# EAGLE design W512A (EAGLE 6.6.0)
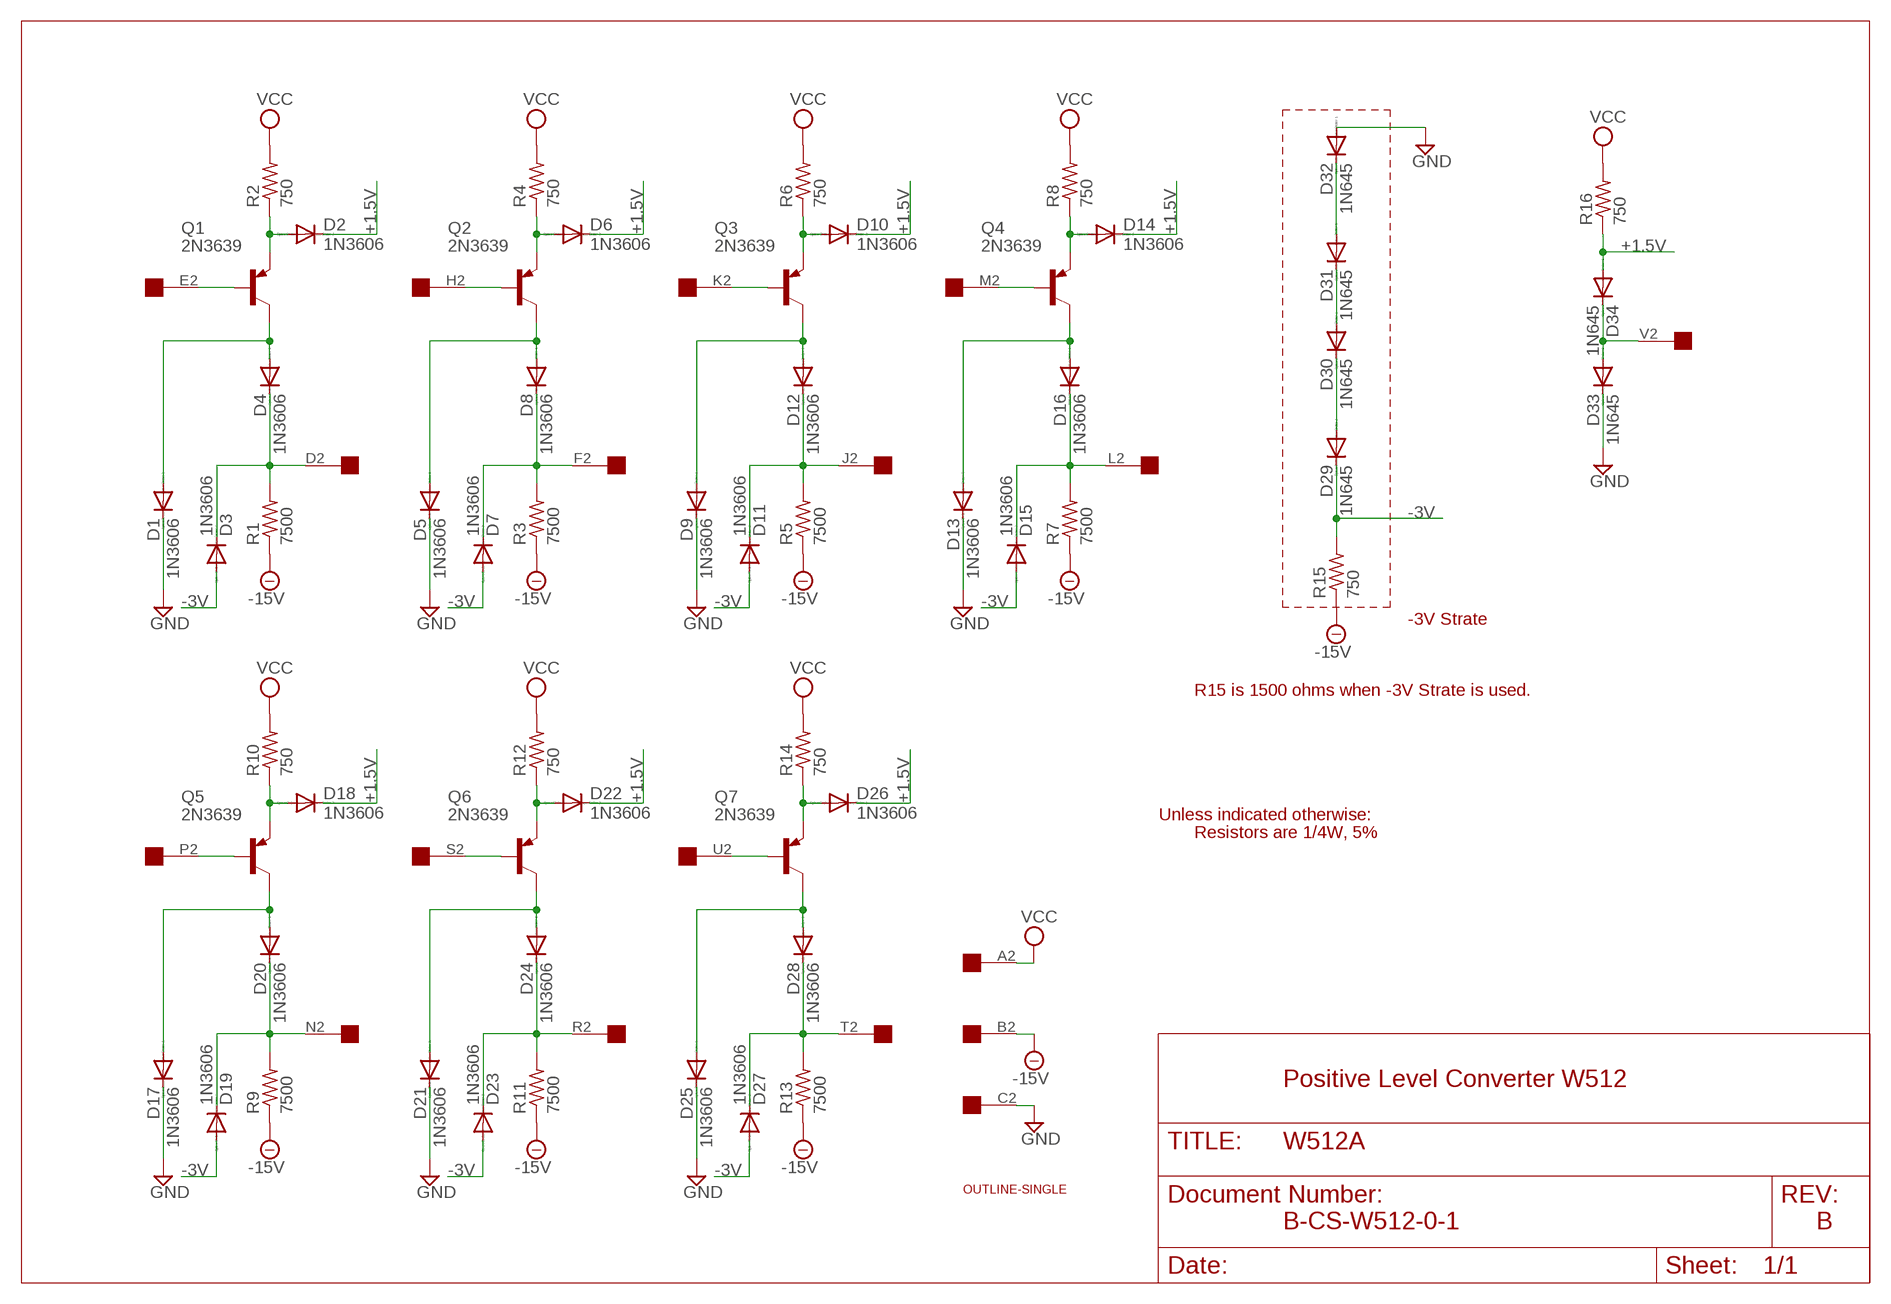
[diagram p0: schematic, sheet 1]

## Parts
D1  1N3606  1N4148DO35-10  [DO35-10]
D2  1N3606  1N4148DO35-10  [DO35-10]
D3  1N3606  1N4148DO35-10  [DO35-10]
D4  1N3606  1N4148DO35-10  [DO35-10]
D5  1N3606  1N4148DO35-10  [DO35-10]
D6  1N3606  1N4148DO35-10  [DO35-10]
D7  1N3606  1N4148DO35-10  [DO35-10]
D8  1N3606  1N4148DO35-10  [DO35-10]
D9  1N3606  1N4148DO35-10  [DO35-10]
D10  1N3606  1N4148DO35-10  [DO35-10]
D11  1N3606  1N4148DO35-10  [DO35-10]
D12  1N3606  1N4148DO35-10  [DO35-10]
D13  1N3606  1N4148DO35-10  [DO35-10]
D14  1N3606  1N4148DO35-10  [DO35-10]
D15  1N3606  1N4148DO35-10  [DO35-10]
D16  1N3606  1N4148DO35-10  [DO35-10]
D17  1N3606  1N4148DO35-10  [DO35-10]
D18  1N3606  1N4148DO35-10  [DO35-10]
D19  1N3606  1N4148DO35-10  [DO35-10]
D20  1N3606  1N4148DO35-10  [DO35-10]
D21  1N3606  1N4148DO35-10  [DO35-10]
D22  1N3606  1N4148DO35-10  [DO35-10]
D23  1N3606  1N4148DO35-10  [DO35-10]
D24  1N3606  1N4148DO35-10  [DO35-10]
D25  1N3606  1N4148DO35-10  [DO35-10]
D26  1N3606  1N4148DO35-10  [DO35-10]
D27  1N3606  1N4148DO35-10  [DO35-10]
D28  1N3606  1N4148DO35-10  [DO35-10]
D29  1N645  1N4148DO35-10  [DO35-10]
D30  1N645  1N4148DO35-10  [DO35-10]
D31  1N645  1N4148DO35-10  [DO35-10]
D32  1N645  1N4148DO35-10  [DO35-10]
D33  1N645  1N4148DO35-10  [DO35-10]
D34  1N645  1N4148DO35-10  [DO35-10]
EDGE  EDGE-1  [EDGE-CON1]
Q1  2N3639  2N2904  [TO39]
Q2  2N3639  2N2904  [TO39]
Q3  2N3639  2N2904  [TO39]
Q4  2N3639  2N2904  [TO39]
Q5  2N3639  2N2904  [TO39]
Q6  2N3639  2N2904  [TO39]
Q7  2N3639  2N2904  [TO39]
R1  7500  R-US_0207/10  [0207/10]
R2  750  R-US_0207/10  [0207/10]
R3  7500  R-US_0207/10  [0207/10]
R4  750  R-US_0207/10  [0207/10]
R5  7500  R-US_0207/10  [0207/10]
R6  750  R-US_0207/10  [0207/10]
R7  7500  R-US_0207/10  [0207/10]
R8  750  R-US_0207/10  [0207/10]
R9  7500  R-US_0207/10  [0207/10]
R10  750  R-US_0207/10  [0207/10]
R11  7500  R-US_0207/10  [0207/10]
R12  750  R-US_0207/10  [0207/10]
R13  7500  R-US_0207/10  [0207/10]
R14  750  R-US_0207/10  [0207/10]
R15  750  R-US_0207/10  [0207/10]
R16  750  R-US_0207/10  [0207/10]
U$1  OUTLINE-SINGLE  [SINGLE]

## Nets
+1.5V: D2.C D6.C D10.C D14.C D18.C D22.C D26.C D34.A R16.1
-3V: D3.A D7.A D11.A D15.A D19.A D23.A D27.A D29.C R15.2
-15V [Supply]: EDGE.B2 R1.1 R3.1 R5.1 R7.1 R9.1 R11.1 R13.1 R15.1
GND [Supply]: D1.C D5.C D9.C D13.C D17.C D21.C D25.C D32.A D33.C EDGE.C2
N$1: D1.A D4.A Q1.3(C)
N$2: D3.C D4.C EDGE.D2 R1.2
N$3: EDGE.H2 Q2.2(B)
N$4: D31.A D32.C
N$5: D30.A D31.C
N$6: D29.A D30.C
N$7: D2.A Q1.1(E) R2.1
N$8: D6.A Q2.1(E) R4.1
N$9: D5.A D8.A Q2.3(C)
N$10: D7.C D8.C EDGE.F2 R3.2
N$11: EDGE.K2 Q3.2(B)
N$12: D10.A Q3.1(E) R6.1
N$13: EDGE.E2 Q1.2(B)
N$14: D9.A D12.A Q3.3(C)
N$15: D11.C D12.C EDGE.J2 R5.2
N$16: EDGE.M2 Q4.2(B)
N$17: D14.A Q4.1(E) R8.1
N$18: D13.A D16.A Q4.3(C)
N$19: D15.C D16.C EDGE.L2 R7.2
N$20: EDGE.P2 Q5.2(B)
N$21: D18.A Q5.1(E) R10.1
N$23: D17.A D20.A Q5.3(C)
N$24: D19.C D20.C EDGE.N2 R9.2
N$25: EDGE.S2 Q6.2(B)
N$26: D22.A Q6.1(E) R12.1
N$27: D21.A D24.A Q6.3(C)
N$28: D23.C D24.C EDGE.R2 R11.2
N$29: EDGE.U2 Q7.2(B)
N$30: D26.A Q7.1(E) R14.1
N$31: D25.A D28.A Q7.3(C)
N$32: D27.C D28.C EDGE.T2 R13.2
N$34: D33.A D34.C EDGE.V2
VCC [Supply]: EDGE.A2 R2.2 R4.2 R6.2 R8.2 R10.2 R12.2 R14.2 R16.2

## Notes on the sheet
- -3V Strate
- R15 is 1500 ohms when -3V Strate is used.
- Unless indicated otherwise:
- Resistors are 1/4W, 5%
- Positive Level Converter W512
- B-CS-W512-0-1 | B

## Library data of the parts
D1-D34 = diode:1N4148: DIODE high speed (Philips)
EDGE = dec-con:EDGE-1: Single-Sided DEC Edge Connector -- (side 2)
Q1-Q7 = transistor-pnp:2N2904*: PNP Transistror
R1-R16 = rcl:R-US_: RESISTOR, American symbol
U$1 = dec-con:OUTLINE-*: Board outlines for DEC boards.

## Net classes
1 Supply: width 0.813 mm

## Board
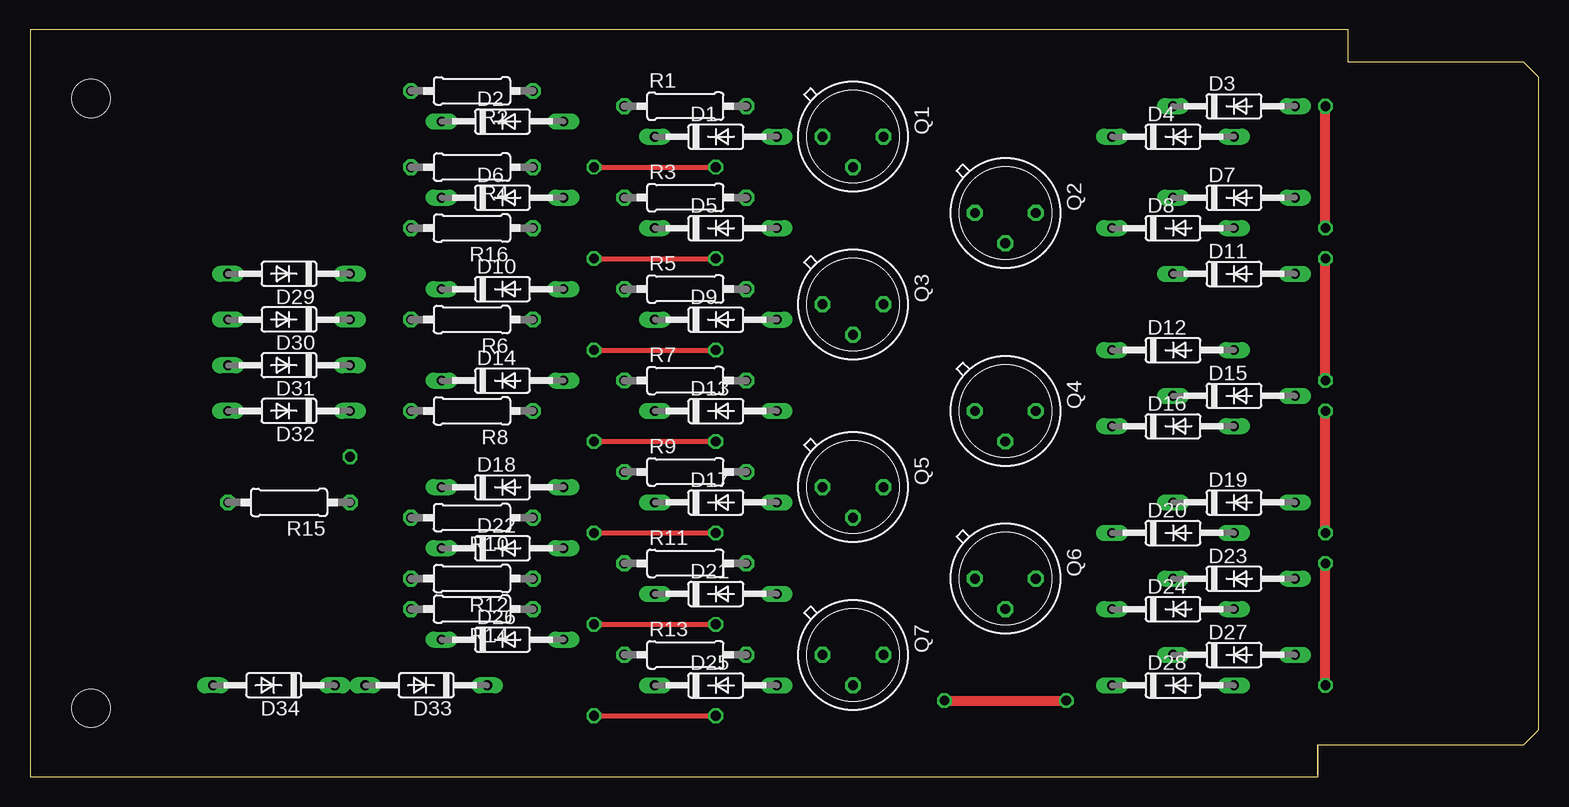
[diagram p1: board, top side]
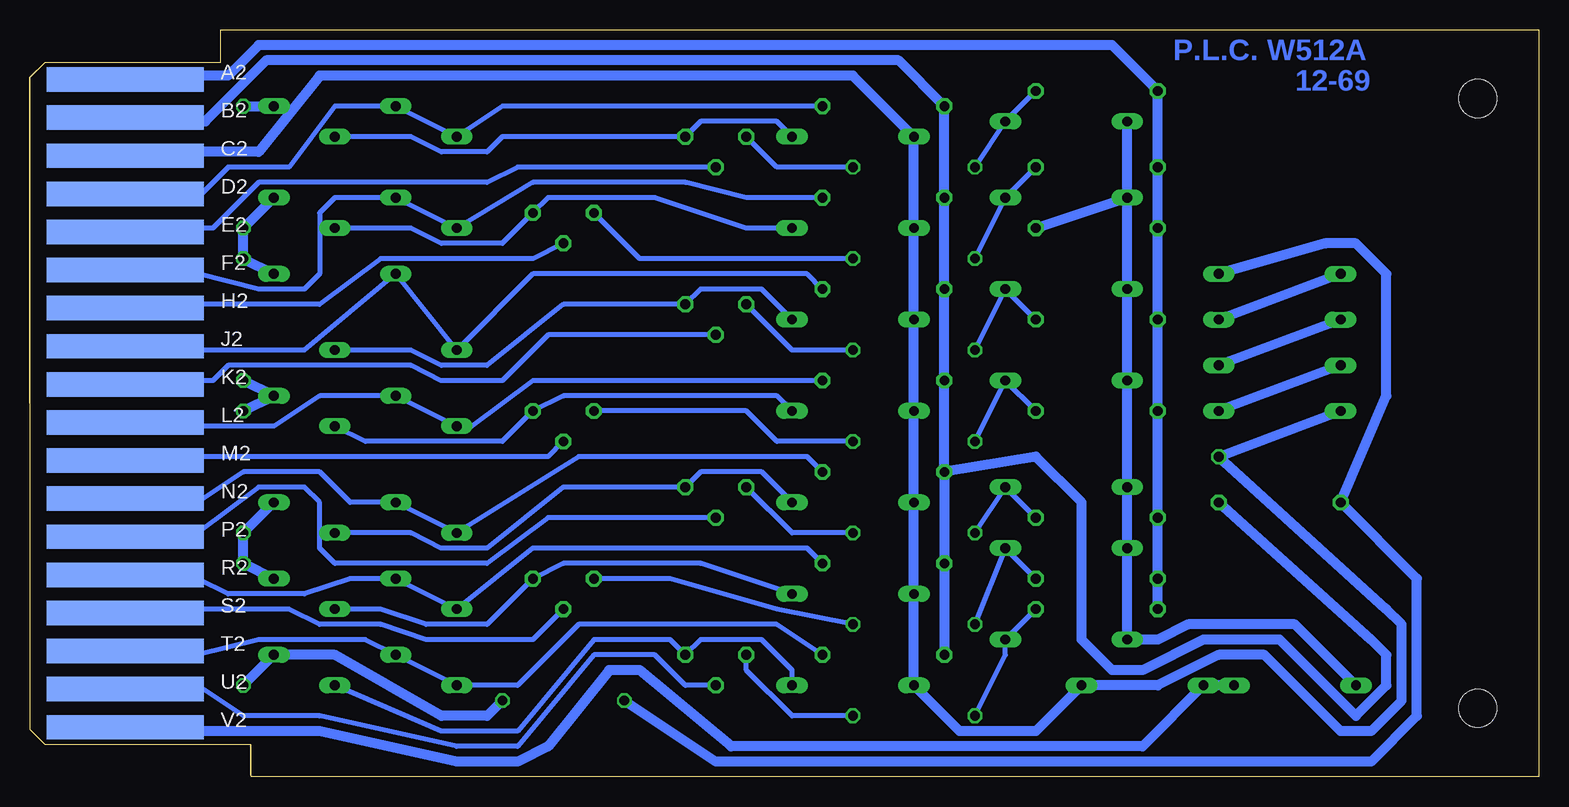
[diagram p2: board, bottom side, seen from below]

Size 125.73 x 62.23 mm. Coordinates in mm from the lower left corner, seen from the top.
Copper layers (1+16): Top 0.035mm / dielectric 1.5mm / Bottom 0.035mm
Design rules "16mils": minimum track width 16mil, minimum drill 32mil, track to track 15mil, track to pad 10mil, pad to pad 10mil, via to via 10mil, smd to smd 10mil, copper to edge 13mil, drill to drill 10mil, minimum pad ring 10mil, minimum via ring 8mil, stop-mask expansion 0mil, vias tented up to drill 0mil, thermal gap 10mil

### Footprints (pad centres in the part's own frame; a part is rotated, then mirrored left to right if it is on the bottom)
DO35-10 = drill 0.813 long: A 5.08,0; C -5.08,0
EDGE-CON1 = smd 13.106 x 2.032 bottom: A2 7.938,4.128; B2 7.938,7.303; C2 7.938,10.477; D2 7.938,13.652; E2 7.938,16.828; F2 7.938,20.003; H2 7.938,23.177; J2 7.938,26.352; K2 7.938,29.527; L2 7.938,32.703; M2 7.938,35.877; N2 7.938,39.053; P2 7.938,42.227; R2 7.938,45.403; S2 7.938,48.578; T2 7.938,51.752; U2 7.938,54.928; V2 7.938,58.102
TO39 = drill 0.813 octagon: 1 0,-2.54; 2 2.54,0; 3 0,2.54
0207/10 = drill 0.813 octagon: 1 -5.08,0; 2 5.08,0
SINGLE = hole 3.175: 120.65,56.515; 120.65,5.715

### Placement (x,y rotation side)
D1  57.15,53.34 0 top
D2  39.37,54.61 0 top
D3  100.33,55.88 0 top
D4  95.25,53.34 0 top
D5  57.15,45.72 0 top
D6  39.37,48.26 0 top
D7  100.33,48.26 0 top
D8  95.25,45.72 0 top
D9  57.15,38.1 0 top
D10  39.37,40.64 0 top
D11  100.33,41.91 0 top
D12  95.25,35.56 0 top
D13  57.15,30.48 0 top
D14  39.37,33.02 0 top
D15  100.33,31.75 0 top
D16  95.25,29.21 0 top
D17  57.15,22.86 0 top
D18  39.37,24.13 0 top
D19  100.33,22.86 0 top
D20  95.25,20.32 0 top
D21  57.15,15.24 0 top
D22  39.37,19.05 0 top
D23  100.33,16.51 0 top
D24  95.25,13.97 0 top
D25  57.15,7.62 0 top
D26  39.37,11.43 0 top
D27  100.33,10.16 0 top
D28  95.25,7.62 0 top
D29  21.59,41.91 180 top
D30  21.59,38.1 180 top
D31  21.59,34.29 180 top
D32  21.59,30.48 180 top
D33  33.02,7.62 180 top
D34  20.32,7.62 180 top
EDGE  125.73,62.23 180 top
Q1  68.58,53.34 270 top
Q2  81.28,46.99 270 top
Q3  68.58,39.37 270 top
Q4  81.28,30.48 270 top
Q5  68.58,24.13 270 top
Q6  81.28,16.51 270 top
Q7  68.58,10.16 270 top
R1  54.61,55.88 0 top
R2  36.83,57.15 180 top
R3  54.61,48.26 0 top
R4  36.83,50.8 180 top
R5  54.61,40.64 0 top
R6  36.83,38.1 180 top
R7  54.61,33.02 0 top
R8  36.83,30.48 180 top
R9  54.61,25.4 0 top
R10  36.83,21.59 180 top
R11  54.61,17.78 0 top
R12  36.83,16.51 180 top
R13  54.61,10.16 0 top
R14  36.83,13.97 180 top
R15  21.59,22.86 180 top
R16  36.83,45.72 180 top
U$1  125.73,62.23 180 top

### Tracks (layer width: path | path; a pad name or v marks a point on that pad's centre or on a via)
+1.5V
  Bottom 0.813: D6.C D2.C | D6.C R16.1 | D6.C D10.C D14.C D18.C D22.C D26.C 31.75,11.43 29.21,12.7 20.32,12.7 D34.A
-3V  (via drill 0.81)
  Top 0.813: v107.95,7.62 v107.95,17.78 | v107.95,20.32 v107.95,30.48 | v107.95,33.02 v107.95,43.18 | v107.95,45.72 v107.95,55.88 | v76.2,6.35 v86.36,6.35
  Bottom 0.813: v107.95,7.62 D27.A 100.33,10.16 91.44,5.08 87.63,5.08 v86.36,6.35 | D19.A v107.95,20.32 v107.95,17.78 D23.A | v107.95,30.48 D15.A v107.95,33.02 | D7.A v107.95,45.72 v107.95,43.18 D11.A | v107.95,55.88 D3.A | D29.C 17.78,44.45 15.24,44.45 12.7,41.91 12.7,31.75 R15.2 10.16,16.51 10.16,5.08 13.97,1.27 68.58,1.27 v76.2,6.35
-15V
  Bottom 0.813: R15.1 13.97,11.43 12.7,10.16 12.7,7.62 15.24,5.08 21.59,11.43 27.94,11.43 33.02,8.89 35.56,8.89 38.1,11.43 38.1,22.86 41.91,26.67 R9.1 | R13.1 R11.1 R9.1 | R9.1 R7.1 R5.1 R3.1 R1.1 53.34,59.69 106.05,59.69 111.12,54.61 116.84,54.61 EDGE.B2
GND  (via drill 0.81)
  Bottom 0.813: D32.A v26.67,26.67 12.7,13.97 11.43,12.7 11.43,6.35 13.97,3.81 16.51,3.81 22.86,10.16 26.67,10.16 31.75,7.62 D33.C 41.91,3.81 48.26,3.81 D25.C D21.C D17.C D13.C D9.C D5.C D1.C 57.15,58.42 101.6,58.42 106.68,52.07 116.84,52.07 EDGE.C2
N$1
  Bottom 0.406: D1.A 63.5,54.61 69.85,54.61 Q1.3 86.36,53.34 87.63,52.07 91.44,52.07 93.98,53.34 D4.A
N$2
  Bottom 0.406: EDGE.D2 116.84,48.26 111.76,48.26 109.22,50.8 104.14,50.8 100.33,55.88 D3.C D4.C 86.36,55.88 R1.2
N$3
  Bottom 0.406: EDGE.H2 116.84,39.37 101.6,39.37 96.52,43.18 83.82,43.18 Q2.2
N$4
  Bottom 0.813: D31.A D32.C
N$5
  Bottom 0.813: D30.A D31.C
N$6
  Bottom 0.813: D29.A D30.C
N$7  (via drill 0.81)
  Top 0.406: v46.99,50.8 v57.15,50.8
  Bottom 0.406: R2.1 D2.A v46.99,50.8 | v57.15,50.8 63.5,50.8 Q1.1
N$8  (via drill 0.81)
  Top 0.406: v46.99,43.18 v57.15,43.18
  Bottom 0.406: R4.1 D6.A v46.99,43.18 | v57.15,43.18 74.93,43.18 Q2.1
N$9
  Bottom 0.406: D5.A 66.04,45.72 73.66,48.26 82.55,48.26 Q2.3 86.36,44.45 91.44,44.45 93.98,45.72 D8.A
N$10
  Bottom 0.406: EDGE.F2 116.84,41.91 111.76,41.91 106.68,40.64 102.87,40.64 101.6,41.91 101.6,46.99 100.33,48.26 D7.C D8.C 83.82,49.53 71.12,49.53 66.04,48.26 R3.2
N$11
  Bottom 0.406: EDGE.K2 116.84,33.02 110.49,33.02 109.22,34.29 93.98,34.29 91.44,33.02 86.36,33.02 82.55,36.83 Q3.2
N$12  (via drill 0.81)
  Top 0.406: v46.99,35.56 v57.15,35.56
  Bottom 0.406: R6.1 D10.A v46.99,35.56 | v57.15,35.56 62.23,35.56 Q3.1
N$13
  Bottom 0.406: EDGE.E2 116.84,45.72 110.49,45.72 106.68,49.53 87.63,49.53 85.09,50.8 Q1.2
N$14
  Bottom 0.406: D12.A 93.98,35.56 91.44,34.29 87.63,34.29 81.28,39.37 Q3.3 69.85,40.64 64.77,40.64 D9.A
N$15
  Bottom 0.406: R5.2 60.96,41.91 83.82,41.91 D12.C D11.C 102.87,35.56 116.84,35.56 EDGE.J2
N$16
  Bottom 0.406: EDGE.M2 115.57,26.67 82.55,26.67 Q4.2
N$17  (via drill 0.81)
  Top 0.406: v46.99,27.94 v57.15,27.94
  Bottom 0.406: R8.1 D14.A v46.99,27.94 | v57.15,27.94 63.5,27.94 66.04,30.48 Q4.1
N$18
  Bottom 0.406: D16.A 97.79,27.94 86.36,27.94 Q4.3 81.28,31.75 63.5,31.75 D13.A
N$19
  Bottom 0.406: EDGE.L2 116.84,29.21 105.41,29.21 101.6,31.75 D15.C D16.C 88.9,29.21 83.82,33.02 R7.2
N$20
  Bottom 0.406: Q5.2 82.55,21.59 87.63,17.78 100.33,17.78 101.6,19.05 101.6,22.86 102.87,24.13 106.68,24.13 111.76,20.32 116.84,20.32 EDGE.P2
N$21  (via drill 0.81)
  Top 0.406: v46.99,20.32 v57.15,20.32
  Bottom 0.406: R10.1 D18.A v46.99,20.32 | v57.15,20.32 62.23,20.32 Q5.1
N$23
  Bottom 0.406: D17.A 64.77,25.4 69.85,25.4 Q5.3 81.28,24.13 87.63,19.05 91.44,19.05 93.98,20.32 D20.A
N$24
  Bottom 0.406: R9.2 60.96,26.67 80.01,26.67 D20.C D19.C 99.06,22.86 101.6,25.4 107.95,25.4 111.76,22.86 116.84,22.86 EDGE.N2
N$25
  Bottom 0.406: EDGE.S2 116.84,13.97 104.14,13.97 101.6,12.7 96.52,12.7 92.71,11.43 83.82,11.43 Q6.2
N$26  (via drill 0.81)
  Top 0.406: v46.99,12.7 v57.15,12.7
  Bottom 0.406: R12.1 D22.A v46.99,12.7 | v57.15,12.7 63.5,13.97 72.39,16.51 Q6.1
N$27
  Bottom 0.406: D21.A 69.85,17.78 81.28,17.78 Q6.3 87.63,12.7 92.71,12.7 96.52,13.97 D24.A
N$28
  Bottom 0.406: R11.2 60.96,19.05 83.82,19.05 D24.C D23.C 99.06,16.51 102.87,15.24 109.22,15.24 111.76,16.51 116.84,16.51 EDGE.R2
N$29
  Bottom 0.406: Q7.2 71.12,7.62 73.66,10.16 78.74,10.16 85.09,2.54 90.17,2.54 101.6,5.08 107.95,5.08 111.76,7.62 116.84,7.62 EDGE.U2
N$30  (via drill 0.81)
  Top 0.406: v46.99,5.08 v57.15,5.08
  Bottom 0.406: R14.1 D26.A 44.45,10.16 v46.99,5.08 | v57.15,5.08 62.23,5.08 66.04,8.89 Q7.1
N$31
  Bottom 0.406: D25.A 62.23,8.89 64.77,11.43 69.85,11.43 Q7.3 72.39,11.43 78.74,11.43 85.09,3.81 91.44,3.81 D28.A
N$32
  Bottom 0.406: R13.2 63.5,12.7 80.01,12.7 85.09,7.62 D28.C D27.C 97.79,11.43 106.68,11.43 111.76,10.16 116.84,10.16 EDGE.T2
N$34
  Bottom 0.813: D34.C D33.A 33.02,2.54 67.31,2.54 74.93,8.89 77.47,8.89 82.55,2.54 85.09,1.27 90.17,1.27 101.6,3.81 117.75,3.81 EDGE.V2
VCC
  Bottom 0.813: EDGE.A2 116.84,58.42 109.22,58.42 106.68,60.96 35.56,60.96 R2.2 R4.2 R16.2 R6.2 R8.2 R10.2 R12.2 R14.2

### Text on the board
Bottom: P.L.C. W512A | 12-69
200bmp: C:/Users/Vince/Documents/websvn/trunk/Eagle/projects/DEC/Wxxx/W512/W512Abackfb.bmp